# EAGLE schematic MFP Schematic (EAGLE 8.1.0)
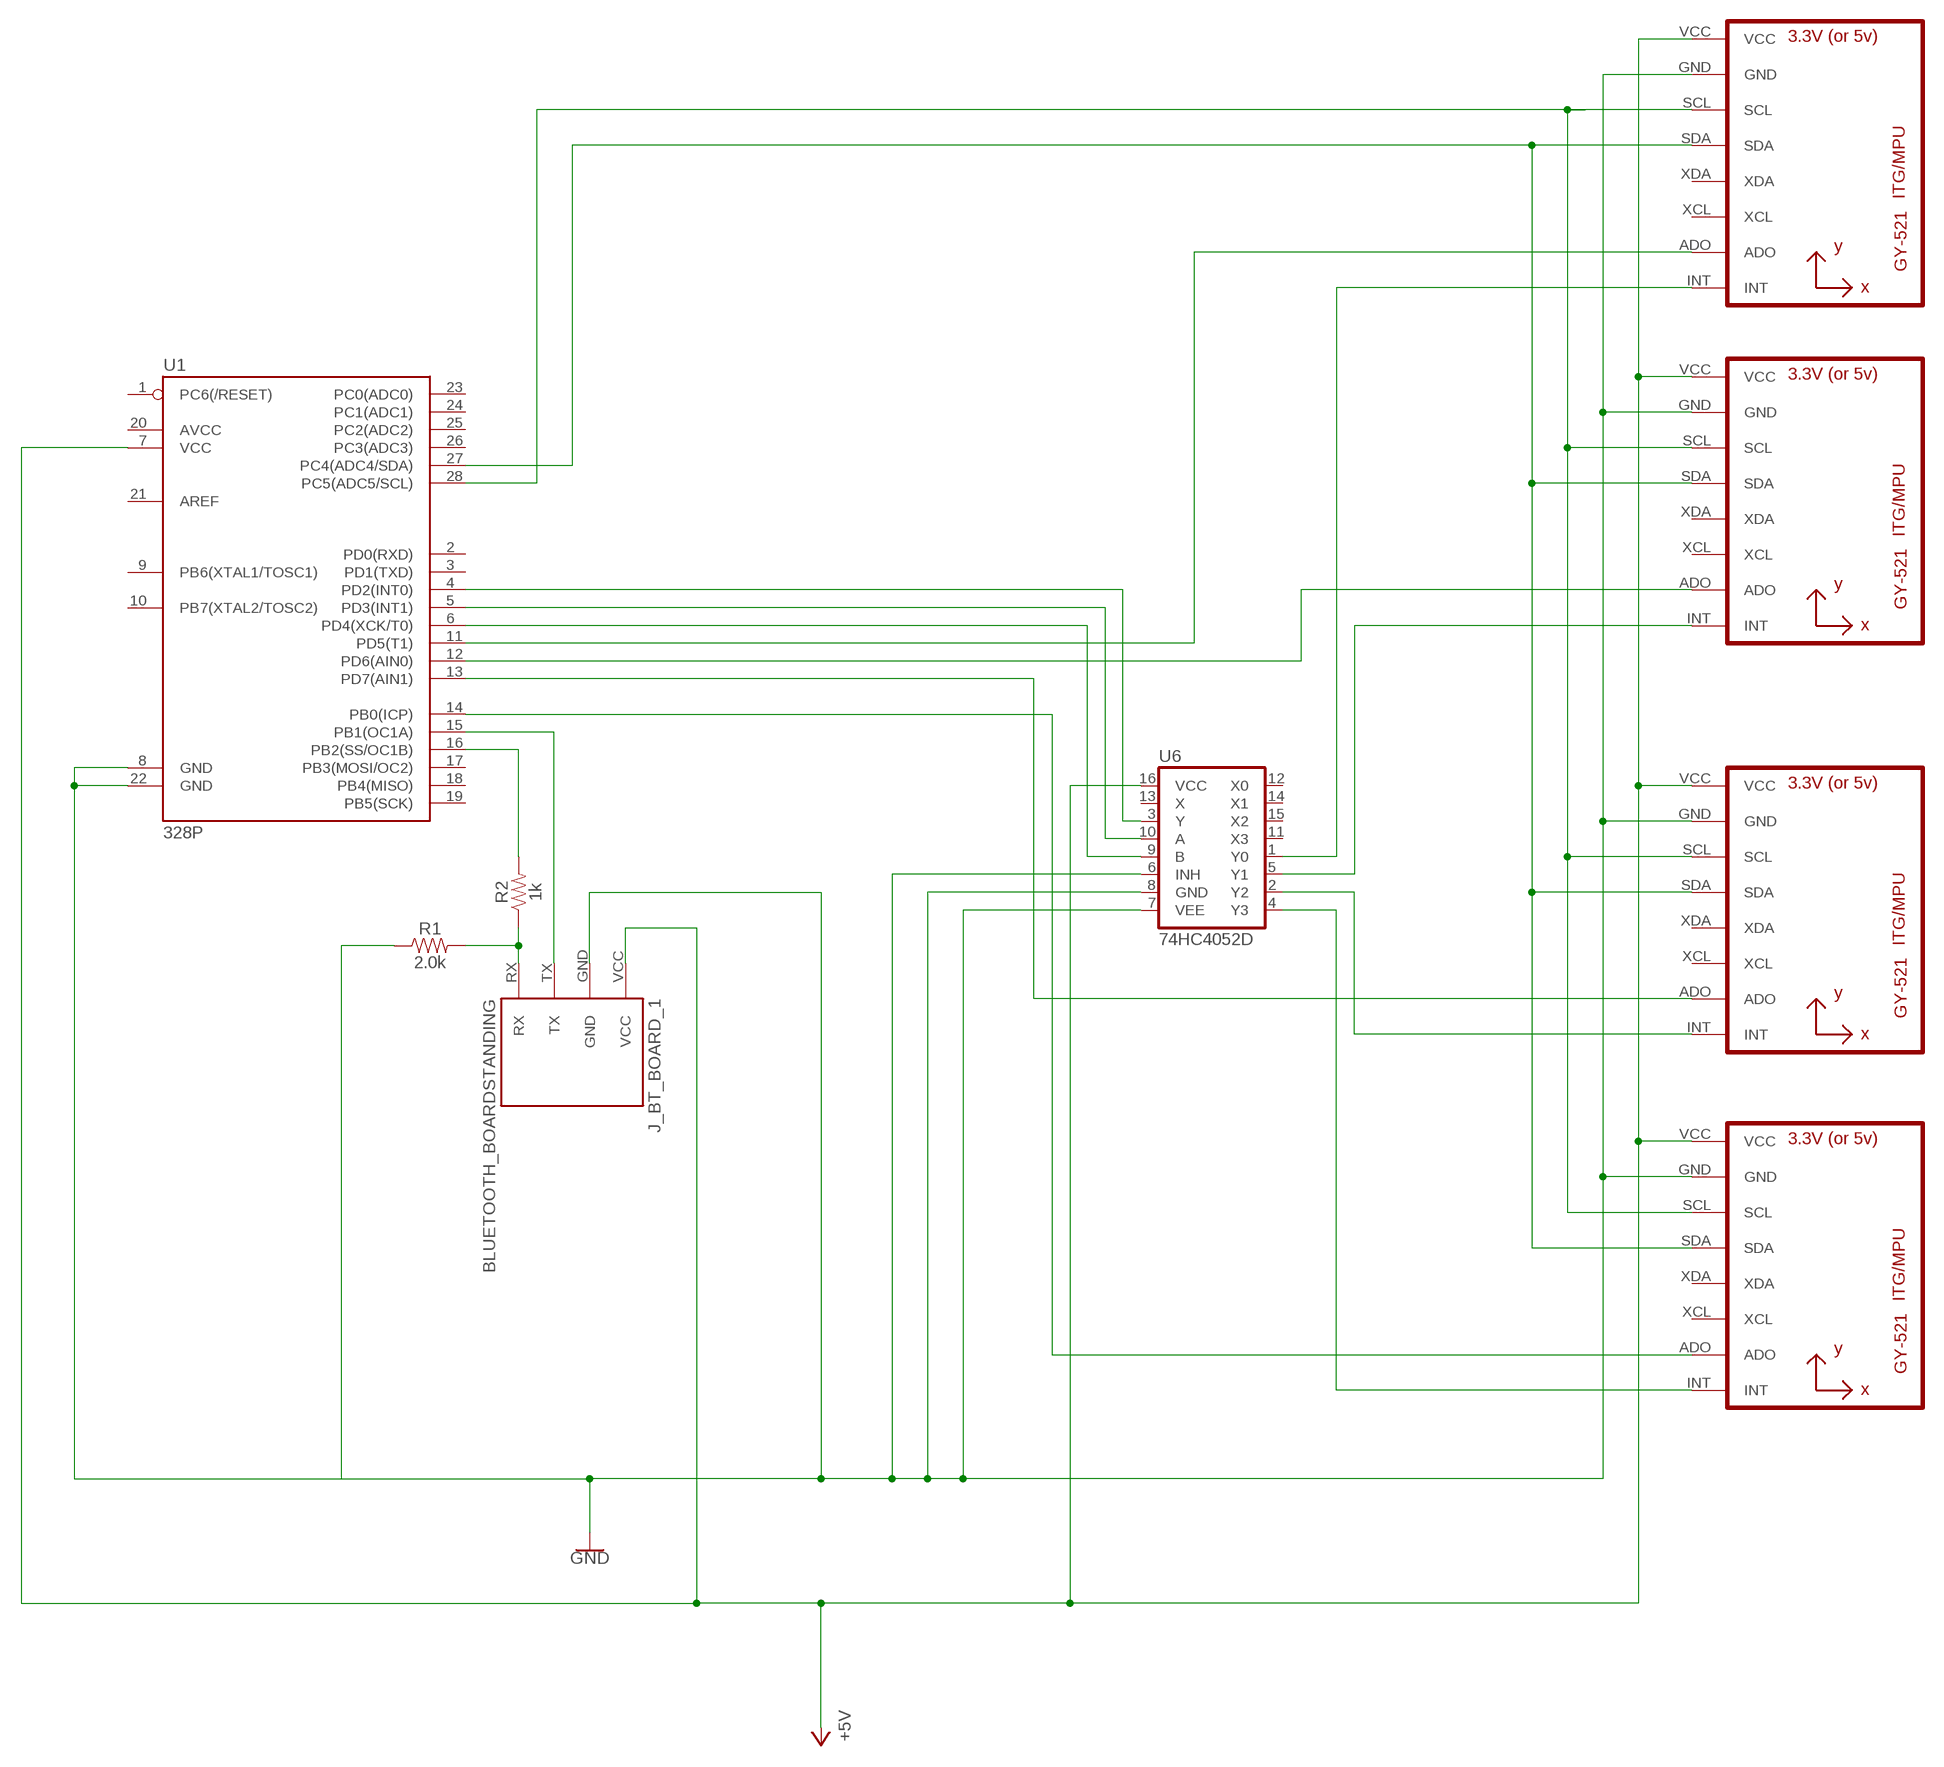
[diagram p0: schematic, sheet 1]

## Parts
J_BT_BOARD_1  BLUETOOTH_BOARDSTANDING  [BT_BOARD_FOOTPRINT_STANDING]
R1  2.0k  2.0KOHM-0603-1/10W-5%  [0603]
R2  1k  1KOHM-0603-1/10W-1%  [0603]
U1  328P  ATMEGA328P_PDIP  [DIP28]
U2  GY-521MPU6050  [GY-521]
U3  GY-521MPU6050  [GY-521]
U4  GY-521MPU6050  [GY-521]
U5  GY-521MPU6050  [GY-521]
U6  74HC4052D  [SO16]

## Nets
+5V: J_BT_BOARD_1.VCC U1.7(VCC) U2.VCC U3.VCC U4.VCC U5.VCC U6.16(VCC)
GND: J_BT_BOARD_1.GND R1.1 U1.8(GND) U1.22(GND) U2.GND U3.GND U4.GND U5.GND U6.6(INH) U6.7(VEE) U6.8(GND)
N$1: U4.INT U6.1(Y0)
N$2: U2.INT U6.5(Y1)
N$3: U3.INT U6.2(Y2)
N$4: U5.INT U6.4(Y3)
N$5: U1.4(PD2(INT0)) U6.3(Y)
N$6: U1.6(PD4(XCK/T0)) U6.9(B)
N$7: U1.5(PD3(INT1)) U6.10(A)
N$8: U1.14(PB0(ICP)) U5.ADO
N$9: U1.13(PD7(AIN1)) U3.ADO
N$10: U1.12(PD6(AIN0)) U2.ADO
N$11: U1.11(PD5(T1)) U4.ADO
N$12: J_BT_BOARD_1.TX U1.15(PB1(OC1A))
N$13: J_BT_BOARD_1.RX R1.2 R2.1
N$14: R2.2 U1.16(PB2(SS/OC1B))
N$17: U1.28(PC5(ADC5/SCL)) U2.SCL U3.SCL U4.SCL U5.SCL
N$18: U1.27(PC4(ADC4/SDA)) U2.SDA U3.SDA U4.SDA U5.SDA
Unconnected: U1.1(PC6(/RESET)) U1.2(PD0(RXD)) U1.3(PD1(TXD)) U1.9(PB6(XTAL1/TOSC1)) U1.10(PB7(XTAL2/TOSC2)) U1.17(PB3(MOSI/OC2)) U1.18(PB4(MISO)) U1.19(PB5(SCK)) U1.20(AVCC) U1.21(AREF) U1.23(PC0(ADC0)) U1.24(PC1(ADC1)) U1.25(PC2(ADC2)) U1.26(PC3(ADC3)) U2.XCL U2.XDA U3.XCL U3.XDA U4.XCL U4.XDA U5.XCL U5.XDA U6.11(X3) U6.12(X0) U6.13(X) U6.14(X1) U6.15(X2)

## Library data of the parts
J_BT_BOARD_1 = Bluetooth HC-05:BLUETOOTH_BOARD: Bluetooth Board V1.05
R1 = SparkFun-Resistors:2.0KOHM: 2kΩ resistor A resistor is a passive two-terminal electrical component that implements electrical resistance as a circuit element. Resistors act to reduce current flow, and, at the same time, act to lower voltage levels within circuits. - Wikipedia; PROD_ID: RES-08296
R2 = SparkFun-Resistors:1KOHM: 1kΩ resistor A resistor is a passive two-terminal electrical component that implements electrical resistance as a circuit element. Resistors act to reduce current flow, and, at the same time, act to lower voltage levels within circuits. - Wikipedia; PROD_ID: RES-07856
U1 = SparkFun-IC-Microcontroller:ATMEGA328P_PDIP: Atmel 328P Through hole ATMEGA328P uC used in the Arduino 32kb flash, 1k EEPROM, 2k SRAM Datasheet <http://www.sparkfun.com/datasheets/Components/SMD/ATMega328.pdf> SparkFun Products Storefront component: AVR 28 Pin 20MHz 32K 6A/D - ATMega328P <https://www.sparkfun.com/products/9061> (COM-09061) SparkFun Simon Says - Through-Hole Soldering Kit <https://www.sparkfun.com/products/10547> (KIT-10547) SparkFun Learn to Solder - Simon Says <https://www.sparkfun.com/products/13708> (KIT-13708) SparkFun BigTime Watch Kit <https://www.sparkfun.com/products/11734> (KIT-11734) SparkFun ClockIt <https://www.sparkfun.com/products/10930> (KIT-10930) SparkFun Serial Enabled LCD Kit <https://www.sparkfun.com/products/10097> (LCD-10097) SparkFun Simon Tilts - Through Hole Soldering Kit <https://www.sparkfun.com/products/12634> (KIT-12634) SparkFun Frequency Counter Kit <https://www.sparkfun.com/products/10140> (KIT-10140) FabFM Radio Kit <https://www.sparkfun.com/products/11043> (KIT-11043) SparkFun Binary Blaster Kit <https://www.sparkfun.com/products/12037> (KIT-12037) SparkFun Metro-Gnome <https://www.sparkfun.com/products/9236> (KIT-09236) ATmega328 with Arduino Optiboot (Uno) <https://www.sparkfun.com/products/10524> (DEV-10524); PROD_ID: IC-09136
U2-U5 = gy-521:GY-521
U6 = SparkFun-IC-Logic:74*4052: Dual 4:1 Analog Mux Dual four-channel analog MULTIPLEXER / DEMULTIPLEXER SparkFun Products SparkFun Vernier Interface Shield <https://www.sparkfun.com/products/12858> (DEV-12858); PROD_ID: IC-13103